# EAGLE schematic Full Water Level Detector Project Schematic (EAGLE 7.4.0)
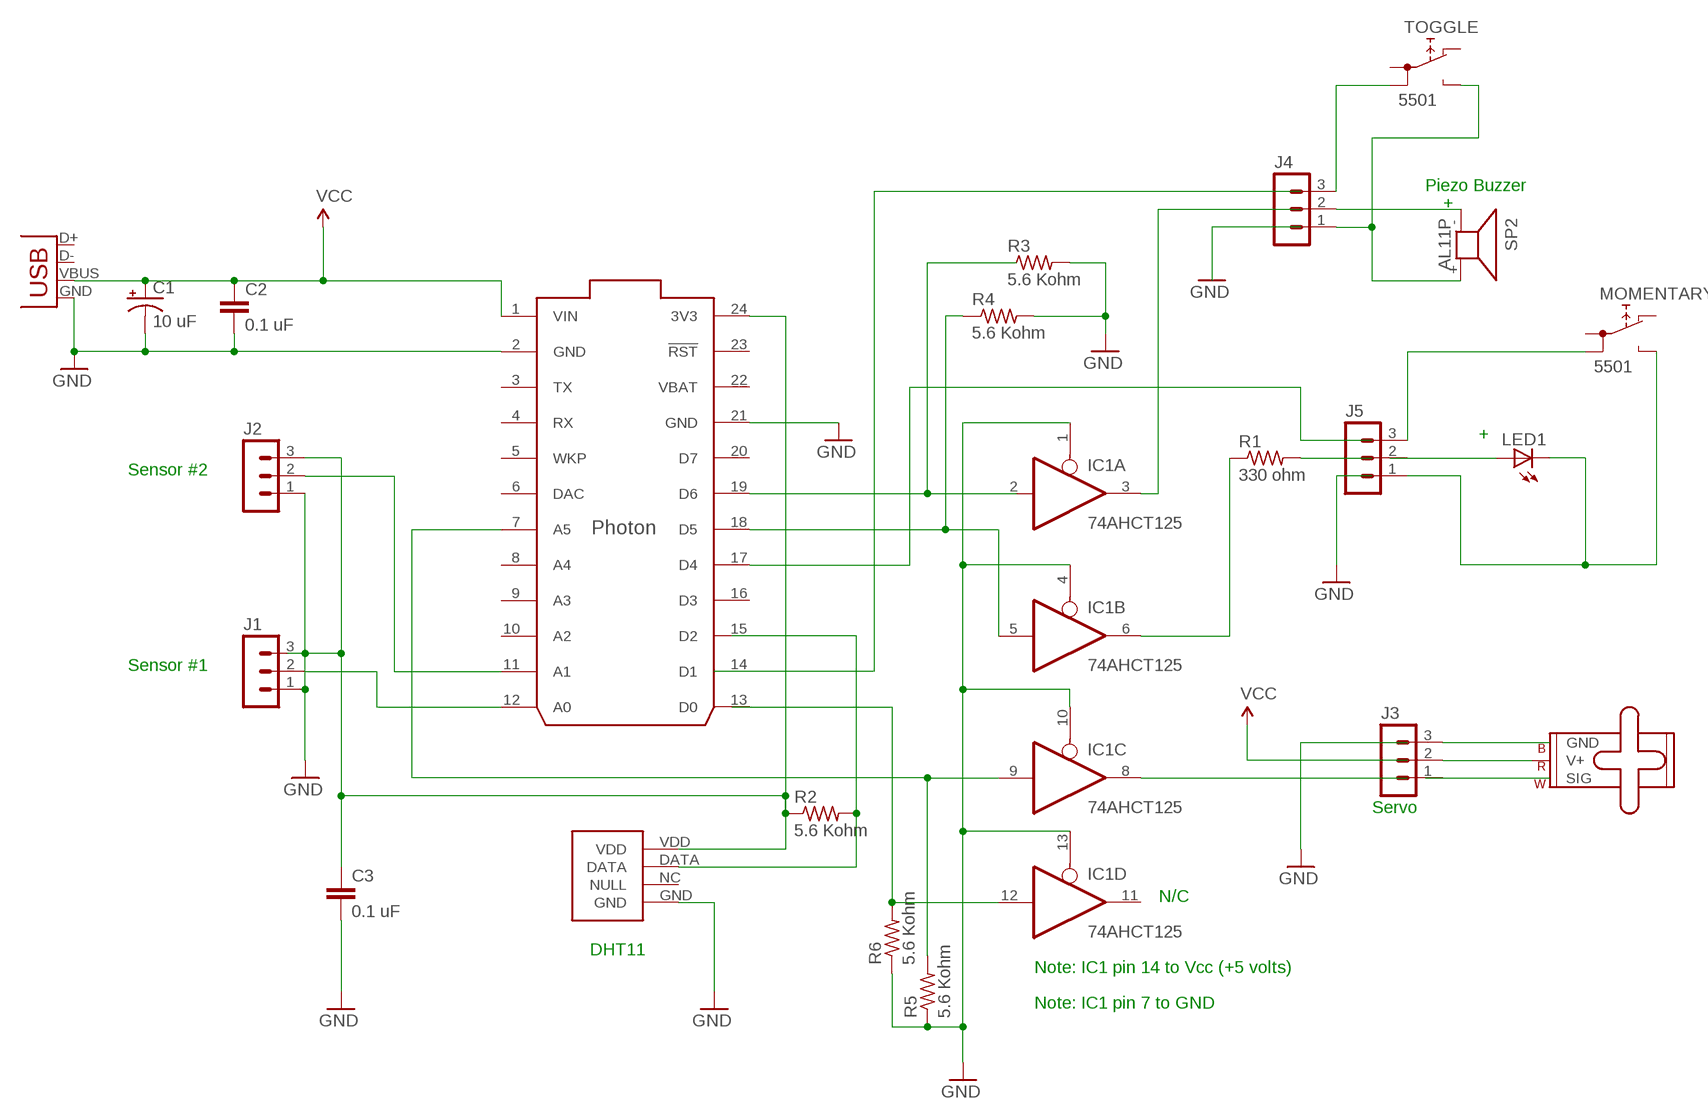
[diagram p0: schematic, sheet 1]

## Parts
C1  10 uF  CAP_POLPTH2  [CPOL-RADIAL-10UF-25V]
C2  0.1 uF  CAPPTH  [CAP-PTH-SMALL]
C3  0.1 uF  CAPPTH  [CAP-PTH-SMALL]
IC1  74AHCT125  74125N  [DIL14]
J1  MA03-1  [MA03-1]
J2  MA03-1  [MA03-1]
J3  MA03-1  [MA03-1]
J4  MA03-1  [MA03-1]
J5  MA03-1  [MA03-1]
JP1  USB-B  USBPTH  [USB-B-PTH]
LED1  LED5MM  [LED5MM]
M1  SMALL_SERVO  [1X03]
MOMENTARY  5501  [5501]
R1  330 ohm  R-US_0309/12  [0309/12]
R2  5.6 Kohm  R-US_0309/12  [0309/12]
R3  5.6 Kohm  R-US_0309/12  [0309/12]
R4  5.6 Kohm  R-US_0309/12  [0309/12]
R5  5.6 Kohm  R-US_0309/12  [0309/12]
R6  5.6 Kohm  R-US_0309/12  [0309/12]
SP2  AL11P  [AL11P]
TOGGLE  5501  [5501]
U$1  PHOTON_SMD  [PHOTON_SMD]
U$2  DHT22  [DHT22]

## Nets
GND: C1.2(-) C2.2 C3.2 IC1.1(A:OE) IC1.4(B:OE) IC1.10(C:OE) IC1.13(D:OE) J1.1 J2.1 JP1.GND R3.2 R4.2 R5.1 R6.1 U$1.2(GND) U$1.21(GND) U$2.GND
N$1: J3.3
N$2: J1.2 U$1.12(A0)
N$3: J2.2 U$1.11(A1)
N$4: J3.2 M1.2(V+)
N$5: U$1.19(D6)
N$6: IC1.5(B:I) R4.1 U$1.18(D5)
N$7: IC1.9(C:I) R5.2 U$1.7(A5)
N$8: C3.1 J1.3 J2.3 R2.1 U$1.24(3V3) U$2.VDD
N$9: IC1.6(B:O) R1.1
N$10: J5.1 LED1.K(C) MOMENTARY.NO
N$11: J4.2 SP2.-
N$12: U$1.17(D4)
N$13: IC1.3(A:O)
N$14: J4.1 SP2.+ TOGGLE.NO
N$15: R1.2
N$17: IC1.12(D:I) R6.2
N$19: R2.2 U$2.DATA
N$20: IC1.8(C:O)
N$21: J4.3 TOGGLE.1B
N$22: LED1.A
N$24: J5.3 MOMENTARY.1B
VCC: C1.1(+) C2.1 JP1.VBUS U$1.1(VIN)
Unconnected: IC1.2(A:I) IC1.11(D:O) J3.1 J5.2 JP1.D+ JP1.D- M1.1(SIG) M1.3(GND) MOMENTARY.1A MOMENTARY.NC R3.1 TOGGLE.1A TOGGLE.NC U$1.3(TX) U$1.4(RX) U$1.5(WKP) U$1.6(DAC) U$1.8(A4) U$1.9(A3) U$1.10(A2) U$1.13(D0) U$1.14(D1) U$1.15(D2) U$1.16(D3) U$1.20(D7) U$1.23(!RST) U$1.25(EN) U$1.26(!SETUP) U$1.27(RGB_RED) U$1.28(RGB_GREEN) U$1.29(RGB_BLUE) U$1.30(USB_D-) U$1.31(USB_D+) U$2.NC(NULL)

## Notes on the sheet
- Piezo Buzzer
- +
- +
- Sensor #2
- Sensor #1
- Servo
- N/C
- DHT11
- Note: IC1 pin 14 to Vcc (+5 volts)
- Note: IC1 pin 7 to GND

## Power pins joined to a net without a drawn wire
GND: IC1.7(P:GND)
VBAT: U$1.22(VBAT)
VCC: IC1.14(P:VCC)

## Library data of the parts
C1 = SparkFun-Passives:CAP_POL: Capacitor Polarized These are standard SMD and PTH capacitors. Normally 10uF, 47uF, and 100uF in electrolytic and tantalum varieties. Always verify the external diameter of the through hole cap, it varies with capacity, voltage, and manufacturer. The EIA devices should be standard.
C2 C3 = SparkFun-Passives:CAP: Capacitor Standard 0603 ceramic capacitor, and 0.1" leaded capacitor.
IC1 = 74xx-us:74*125: Quad bus BUFFER, 3-state
J1-J5 = con-lstb:MA03-1: PIN HEADER; OC_FARNELL: unknown; OC_NEWARK: unknown
JP1 = SparkFun-Connectors:USB: USB Connectors USB-B-PTH is fully proven SKU : PRT-00139/CONN-08278 USB-miniB is fully proven SKU : PRT-00587 USB-A-PCB is untested. USB-A-H is throughly reviewed, but untested. Spark Fun Electronics SKU : PRT-00437 USB-B-SMT is throughly reviewed, but untested. Needs silkscreen touching up. USB-A-S has not been used/tested USB-MB-H has not been used/tested USB-MICROB has been used. CONN-09505; PROD_ID: CONN-08278
LED1 = led:LED: LED OSRAM: - CHIPLED LG R971, LG N971, LY N971, LG Q971, LY Q971, LO R971, LY R971 LH N974, LH R974 LS Q976, LO Q976, LY Q976 LO Q996 - Hyper CHIPLED LW Q18S LB Q993, LB Q99A, LB R99A - SideLED LS A670, LO A670, LY A670, LG A670, LP A670 LB A673, LV A673, LT A673, LW A673 LH A674 LY A675 LS A676, LA A676, LO A676, LY A676, LW A676 LS A679, LY A679, LG A679 - Hyper Micro SIDELED® LS Y876, LA Y876, LO Y876, LY Y876 LT Y87S - SmartLED LW L88C, LW L88S LB L89C, LB L89S, LG L890 LS L89K, LO L89K, LY L89K LS L896, LA L896, LO L896, LY L896 - TOPLED LS T670, LO T670, LY T670, LG T670, LP T670 LSG T670, LSP T670, LSY T670, LOP T670, LYG T670 LG T671, LOG T671, LSG T671 LB T673, LV T673, LT T673, LW T673 LH T674 LS T676, LA T676, LO T676, LY T676, LB T676, LH T676, LSB T676, LW T676 LB T67C, LV T67C, LT T67C, LS T67K, LO T67K, LY T67K, LW E67C LS E67B, LA E67B, LO E67B, LY E67B, LB E67C, LV E67C, LT E67C LW T67C LS T679, LY T679, LG T679 LS T770, LO T770, LY T770, LG T770, LP T770 LB T773, LV T773, LT T773, LW T773 LH T774 LS E675, LA E675, LY E675, LS T675 LS T776, LA T776, LO T776, LY T776, LB T776 LHGB T686 LT T68C, LB T68C - Hyper Mini TOPLED® LB M676 - Mini TOPLED Santana® LG M470 LS M47K, LO M47K, LY M47K Source: http://www.osram.convergy.de LUXEON: - LUMILED® LXK2-PW12-R00, LXK2-PW12-S00, LXK2-PW14-U00, LXK2-PW14-V00 LXK2-PM12-R00, LXK2-PM12-S00, LXK2-PM14-U00 LXK2-PE12-Q00, LXK2-PE12-R00, LXK2-PE12-S00, LXK2-PE14-T00, LXK2-PE14-U00 LXK2-PB12-K00, LXK2-PB12-L00, LXK2-PB12-M00, LXK2-PB14-N00, LXK2-PB14-P00, LXK2-PB14-Q00 LXK2-PR12-L00, LXK2-PR12-M00, LXK2-PR14-Q00, LXK2-PR14-R00 LXK2-PD12-Q00, LXK2-PD12-R00, LXK2-PD12-S00 LXK2-PH12-R00, LXK2-PH12-S00 LXK2-PL12-P00, LXK2-PL12-Q00, LXK2-PL12-R00 Source: www.luxeon.com KINGBRIGHT: KA-3528ASYC Source: www.kingbright.com
M1 = SparkFun-Electromechanical:SMALL_SERVO: Small servo motor This is the small servo used in the SIK. SKU: ROB-09065
MOMENTARY TOGGLE = switch:55?: PUSHBUTTON SERIES 5500 SWITCHES Source: www.e-switch.com .. 5500.pdf
R1-R6 = rcl:R-US_: RESISTOR, American symbol
SP2 = buzzer:AL11P: SPEAKER Source: Buerklin; OC_FARNELL: unknown; OC_NEWARK: unknown
U$1 = Spark:PHOTON_SMD: Photon (without headers) - designed to be surface mounted with 7 extra exposed pads on the bottom of the board which include, 3 RGB LED outputs, /SETUP, EN (3.3V SMPS enable input), USB D+ and USB D-.
U$2 = Spark:DHT22